# EAGLE design ArduCT-v4 (EAGLE 5.07)
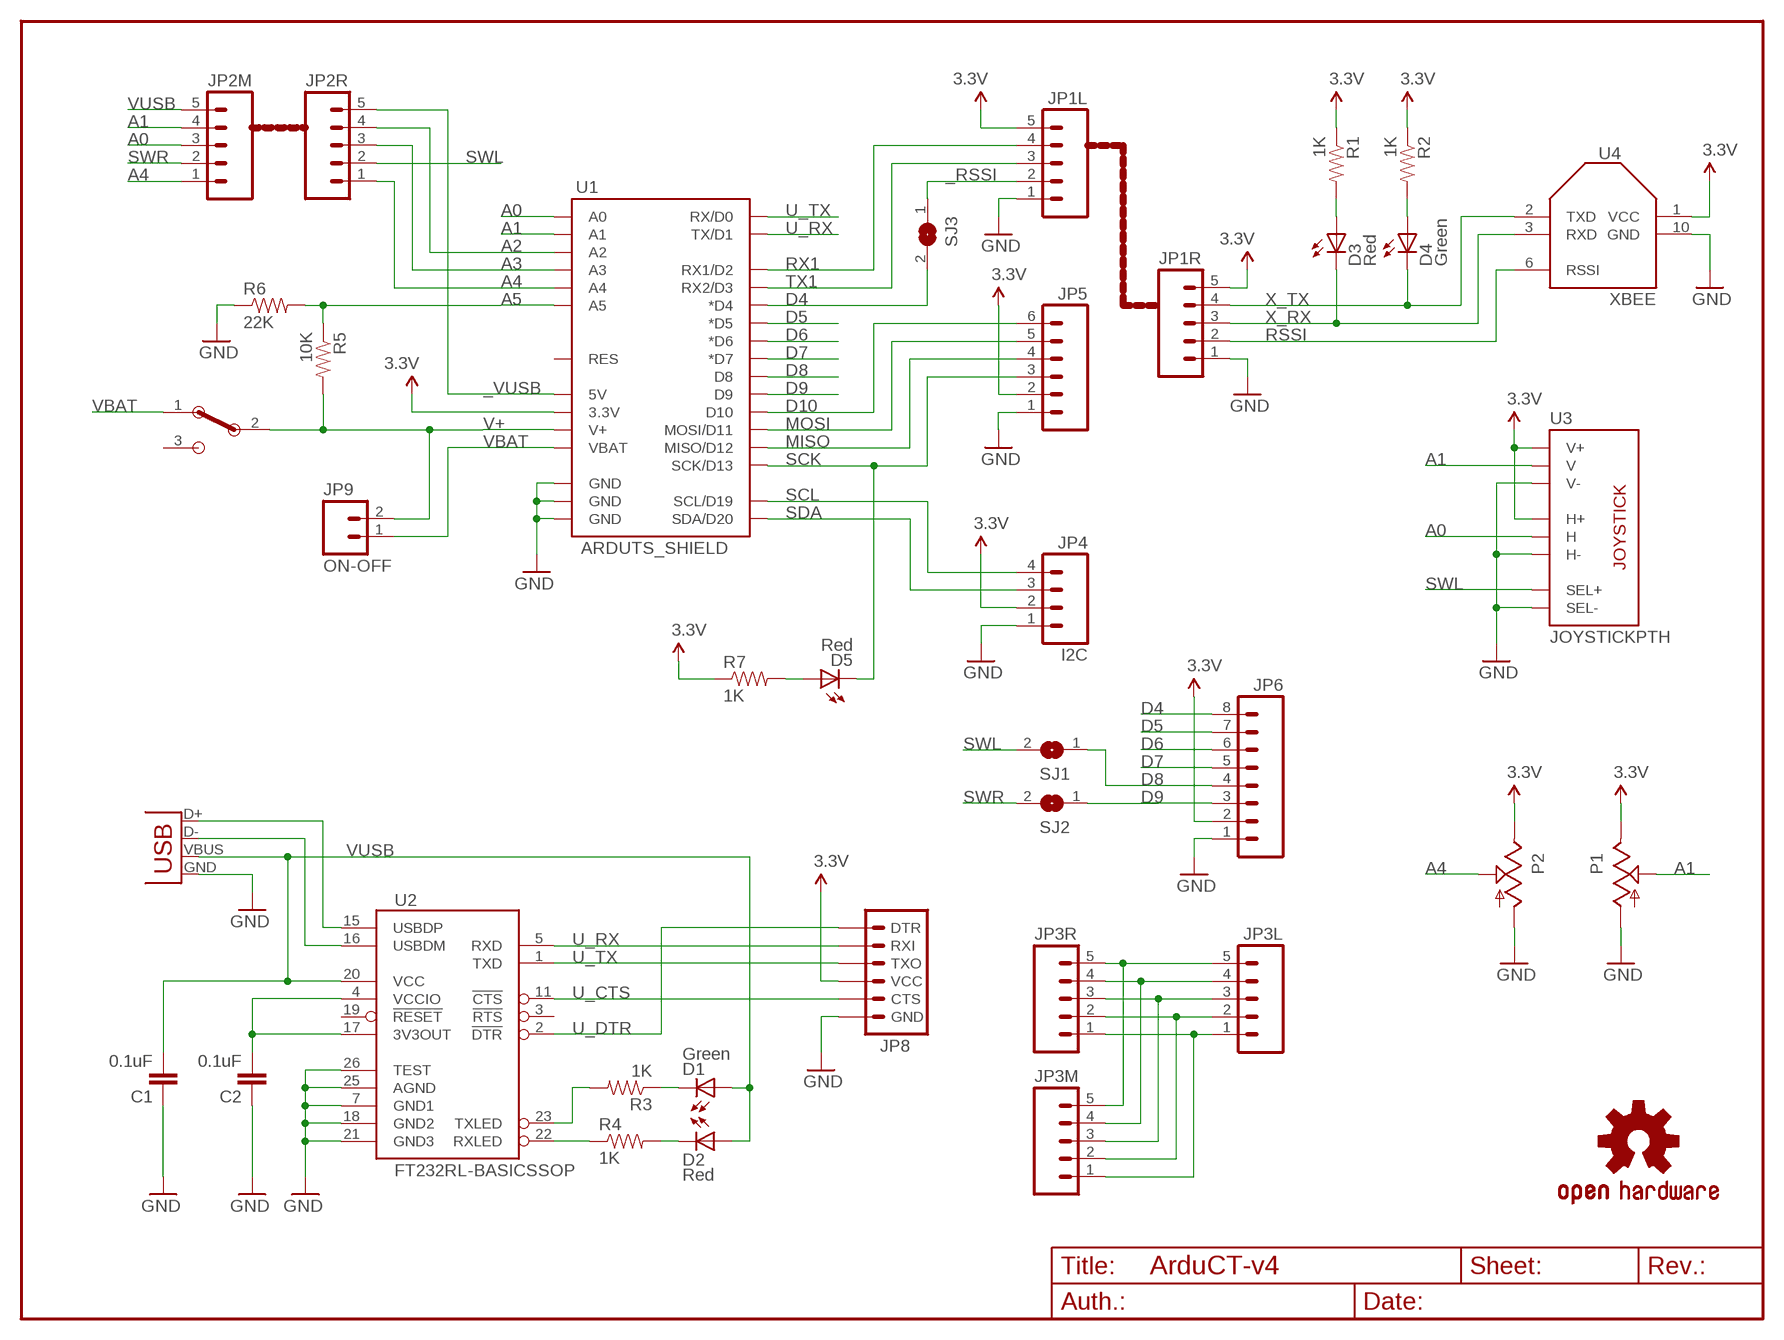
[diagram p0: schematic, sheet 1]

## Parts
C1  0.1uF  CAP0805  [0805]
C2  0.1uF  CAP0805  [0805]
D1  Green  LED  [LED]
D2  Red  LED  [LED]
D3  Red  LED  [LED]
D4  Green  LED  [LED]
D5  Red  LED  [LED]
JP1L  M05  [2+3]
JP1R  M05  [2+3]
JP2M  M05  [2+3]
JP2R  M05  [2+3]
JP3L  M05  [2+3]
JP3M  M05  [2+3]
JP3R  M05  [2+3]
JP4  I2C  M04  [1X04]
JP5  M06SIP  [1X06]
JP6  M08  [1X08]
JP8  ARDUINO_SERIAL_PROGRAM  [1X06_F]
JP9  ON-OFF  M02  [1X02]
P1  POT  [ALPS_POT]
P2  POT  [ALPS_POT]
R1  1K  RESISTOR0805-RES  [0805]
R2  1K  RESISTOR0805-RES  [0805]
R3  1K  RESISTOR0805-RES  [0805]
R4  1K  RESISTOR0805-RES  [0805]
R5  10K  RESISTOR0805-RES  [0805]
R6  22K  RESISTOR0805-RES  [0805]
R7  1K  RESISTOR0805-RES  [0805]
S4  EG1224  [EG1224]
SJ1  SJ  [SJ]
SJ2  SJ  [SJ]
SJ3  SJ  [SJ]
U1  ARDUTS_SHIELD  ARDUTS_SHIELDSPLIT  [ARDUTS_SHIELD_SPLIT]
U2  FT232RL-BASICSSOP  [SSOP28DB]
U3  JOYSTICKPTH  [JOYSTICK]
U4  XBEE  XBEE-RSSI  [XBEE-SMD]
U$1  OSHW-LOGOM  [OSHW-LOGO-M]
X1  USBSMD  [USB-MINIB]

## Nets
3.3V: JP1L.5 JP1R.5 JP4.2 JP5.2 JP6.2 JP8.4(VCC) P1.P$1(E) P2.P$1(E) R1.1 R2.1 R7.1 U1.3.3V U3.H1(H+) U3.V1(V+) U4.1(VCC)
_RSSI: JP1L.2 SJ3.1
_VUSB: JP2R.5 U1.5V
A0: JP2M.3 U1.A0 U3.H2(H)
A1: JP2M.4 P1.P$2(S) U1.A1 U3.V2(V)
A2: JP2R.4 U1.A2
A3: JP2R.3 U1.A3
A4: JP2M.1 JP2R.1 P2.P$2(S) U1.A4
A5: R5.1 R6.2 U1.A5
D4: JP6.8 SJ3.2 U1.D4(*D4)
D5: JP6.7 U1.D5(*D5)
D6: JP6.6 U1.D6(*D6)
D7: JP6.5 U1.D7(*D7)
D8: JP6.4 SJ1.1 U1.D8
D9: JP6.3 SJ2.1 U1.D9
D10: JP5.6 U1.D10
GND [vcc]: C1.1 C2.1 JP1L.1 JP1R.1 JP4.1 JP5.1 JP6.1 JP8.6(GND) P1.P$3(A) P2.P$3(A) R6.1 U1.GND@0(GND) U1.GND@1(GND) U1.GND@2(GND) U2.7(GND1) U2.18(GND2) U2.21(GND3) U2.25(AGND) U2.26(TEST) U3.B2A(SEL-) U3.H3(H-) U3.V3(V-) U4.10(GND) X1.GND
MISO: JP5.4 U1.D12(MISO/D12)
MOSI: JP5.5 U1.D11(MOSI/D11)
N$4: JP3L.4 JP3M.4 JP3R.4
N$5: JP3L.3 JP3M.3 JP3R.3
N$6: JP3L.2 JP3M.2 JP3R.2
N$7: JP3L.5 JP3M.5 JP3R.5
N$8: D5.A1(A) R7.2
N$9: U2.15(USBDP) X1.D+
N$10: U2.16(USBDM) X1.D-
N$14: D3.A1(A) R1.2
N$18: R3.2 U2.23(TXLED)
N$19: C2.2 U2.4(VCCIO) U2.17(3V3OUT)
N$22: R4.1 U2.22(RXLED)
N$25: D4.A1(A) R2.2
RSSI: JP1R.2 U4.6(RSSI)
RX1: JP1L.4 U1.D2(RX1/D2)
SCK: D5.C1(C) JP5.3 U1.D13(SCK/D13)
SCL: JP4.4 U1.D19(SCL/D19)
SDA: JP4.3 U1.D20(SDA/D20)
SWL: JP2R.2 SJ1.2 U3.B1A(SEL+)
SWR: JP2M.2 SJ2.2
TX1: JP1L.3 U1.D3(RX2/D3)
U_CTS: JP8.5(CTS) U2.11(!CTS)
U_DTR: JP8.1(DTR) U2.2(!DTR)
U_RX: JP8.2(RXI) U1.TX(TX/D1) U2.5(RXD)
U_RX_LED: D2.C1(C) R4.2
U_TX: JP8.3(TXO) U1.RX(RX/D0) U2.1(TXD)
U_TX_LED: D1.C1(C) R3.1
V+: JP9.2 R5.2 S4.2 U1.V+
VBAT: JP9.1 S4.1 U1.VBAT
VGND [vcc]: JP3L.1 JP3M.1 JP3R.1
VUSB: C1.2 D1.A1(A) D2.A1(A) JP2M.5 U2.20(VCC) X1.VBUS
X_RX: D3.C1(C) JP1R.3 U4.3(RXD)
X_TX: D4.C1(C) JP1R.4 U4.2(TXD)
Unconnected: S4.3 U1.RES U2.3(!RTS) U2.19(!RESET)

## Library data of the parts
C1 C2 = SparkFun:CAP: Capacitor Standard 0603 ceramic capacitor, and 0.1" leaded capacitor.
D1-D5 = wibauxl:LED
JP1L JP1R JP2M JP2R JP3L JP3M JP3R = wibauxl:M05
JP4 = wibauxl:M04
JP5 = SparkFun:M06: Header 6 Standard 6-pin 0.1" header. Use with straight break away headers (SKU : PRT-00116), right angle break away headers (PRT-00553), swiss pins (PRT-00743), machine pins (PRT-00117), and female headers (PRT-00115). Molex polarized connector foot print use with SKU : PRT-08094 with associated crimp pins and housings. NOTES ON THE VARIANTS LOCK and LOCK_LONGPADS... This footprint was designed to help hold the alignment of a through-hole component (i.e. 6-pin header) while soldering it into place. You may notice that each hole has been shifted either up or down by 0.005 of an inch from it's more standard position (which is a perfectly straight line). This slight alteration caused the pins (the squares in the middle) to touch the edges of the holes. Because they are alternating, it causes a "brace" to hold the component in place. 0.005 has proven to be the perfect amount of "off-center" position when using our standard breakaway headers. Although looks a little odd when you look at the bare footprint, once you have a header in there, the alteration is very hard to notice. Also, if you push a header all the way into place, it is covered up entirely on the bottom side. This idea of altering the position of holes to aid alignment will be further integrated into the Sparkfun Library for other footprints. It can help hold any component with 3 or more connection pins.
JP6 = wibauxl:M08
JP8 = wibauxl:ARDUINO_SERIAL_PROGRAM
JP9 = wibauxl:M02
P1 P2 = SparkFun:POT
R1-R7 = SparkFun:RESISTOR: Resistor Basic schematic elements and footprints for 0603, 1206, and PTH resistors.
S4 = wibauxl:EG1224
SJ1-SJ3 = jumper:SJ: SMD solder JUMPER
U1 = wibauxl:ARDUTS_SHIELD
U2 = wibauxl:FT232RL-BASIC: USB UART This is the simplified version of the FT232RL unit. Only what you need, nothing you don't. Spark Fun Electronics SKU : COM-00650
U3 = SparkFun:JOYSTICK: Thumb Joystick Joystick commonly found in PS2 controllers. Two pots and a select switch. Footprint proven. Spark Fun Electronics SKU : COM-09032
U4 = wibauxl:XBEE-RSSI
U$1 = SparkFun:OSHW-LOGO: Open Source Hardware Logo This logo indicates the piece of hardware it is found on incorporates a OSHW license and/or adheres to the definition of open source hardware found here: http://freedomdefined.org/OSHW
X1 = SparkFun:USB: USB Connectors USB-B-PTH is fully proven SKU : PRT-00139 USB-miniB is fully proven SKU : PRT-00587 USB-A-PCB is untested. USB-A-H is throughly reviewed, but untested. Spark Fun Electronics SKU : PRT-00437 USB-B-SMT is throughly reviewed, but untested. Needs silkscreen touching up. USB-A-S has not been used/tested USB-MB-H has not been used/tested

## Net classes
0 default: width 0.203 mm
1 vcc: width 0.254 mm

## Board
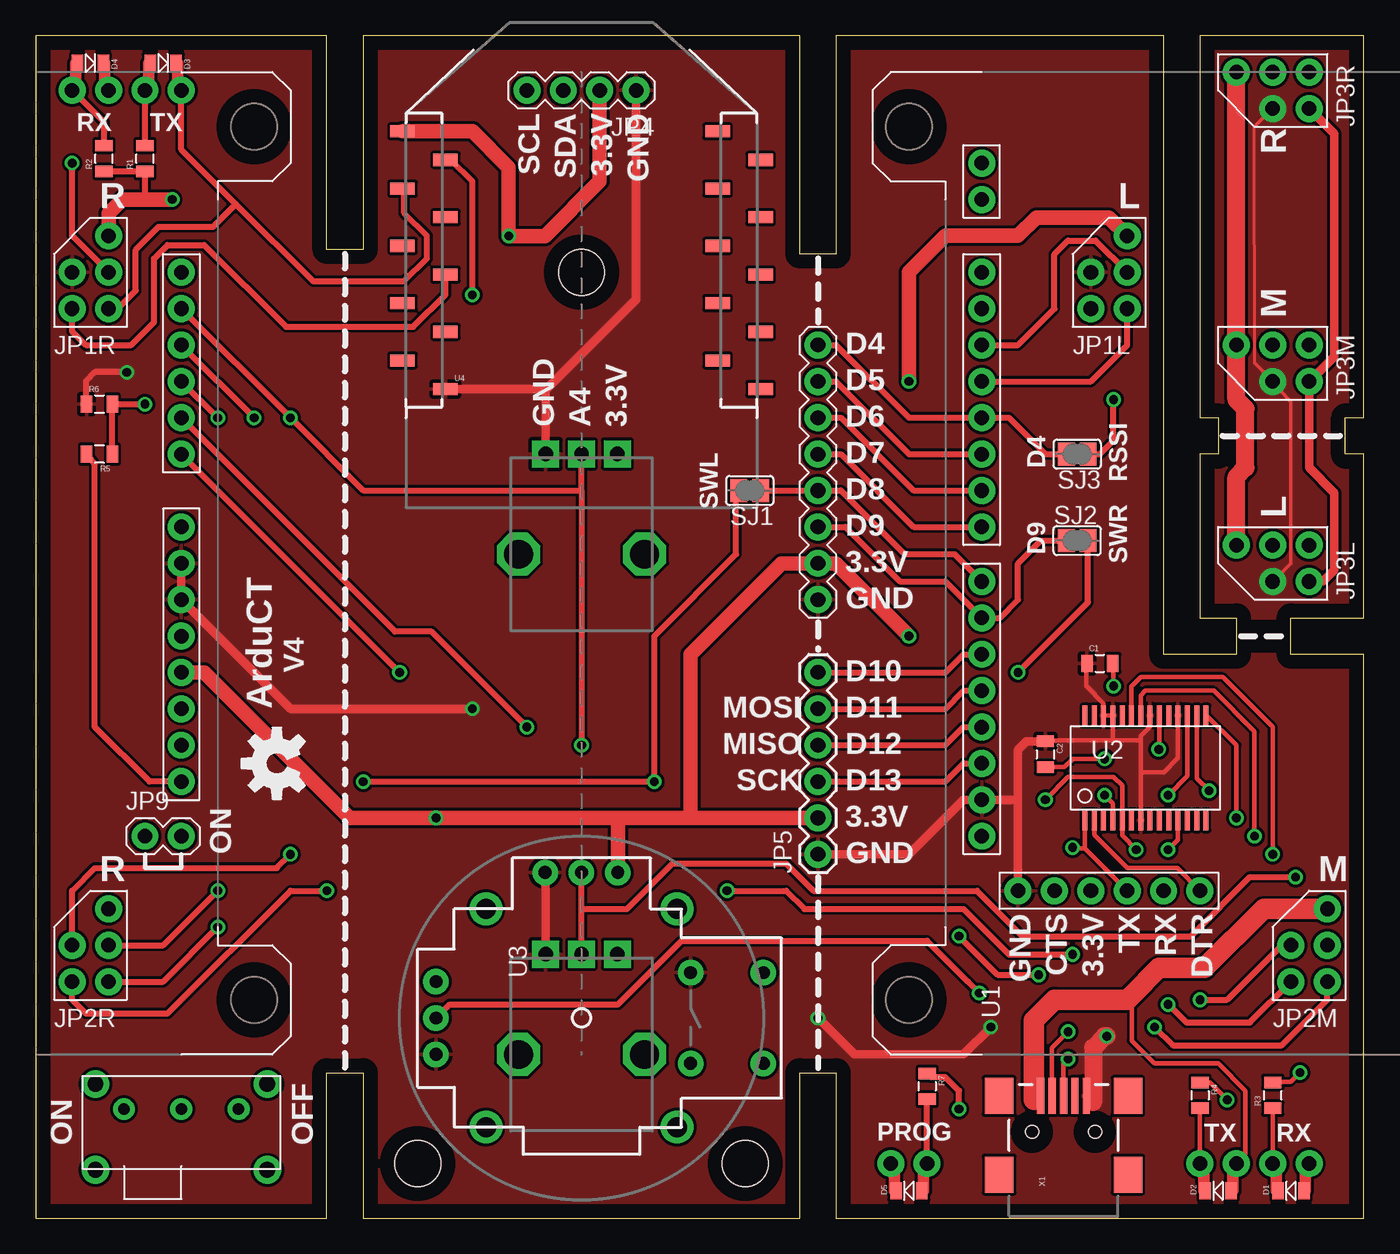
[diagram p1: board, top side]
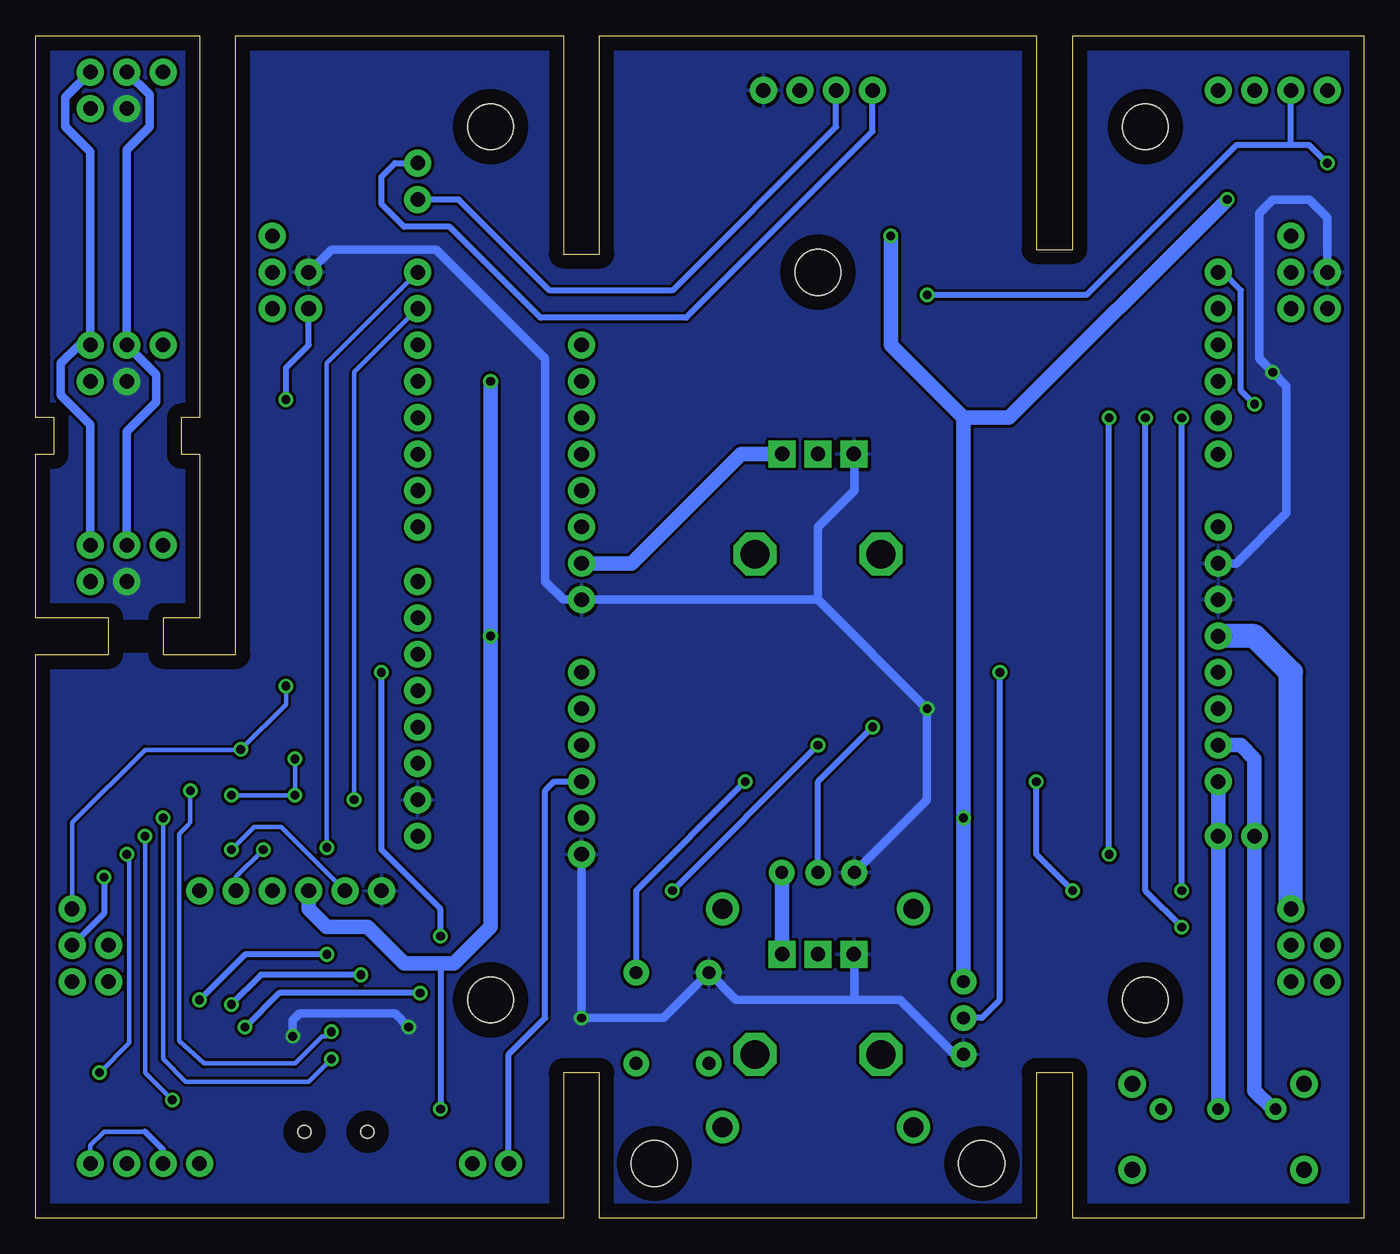
[diagram p2: board, bottom side, seen from below]

Size 92.71 x 82.55 mm. Coordinates in mm from the lower left corner, seen from the top.
Outline: 0,0 20.32,0 20.32,10.16 22.86,10.16 22.86,0 53.34,0 53.34,10.16 55.88,10.16 55.88,0 92.7,0 92.71,39.37 87.63,39.37 87.63,41.91 92.71,41.91 92.71,53.34 91.44,53.34 91.44,55.88 92.71,55.88 92.71,82.54 81.28,82.54 81.28,55.88 82.55,55.88 82.55,53.34 81.28,53.34 81.28,41.91 83.82,41.91 83.82,39.37 78.74,39.37 78.74,82.55 55.88,82.55 55.88,67.31 53.34,67.31 53.34,82.55 22.86,82.55 22.86,67.63 20.32,67.63 20.32,82.54 0,82.54 0,0
Copper layers (1*16): Top 0.035mm / dielectric 1.5mm / Bottom 0.035mm
Design rules "default *": minimum track width 10mil, minimum drill 24mil, track to track 8mil, track to pad 8mil, pad to pad 8mil, via to via 8mil, smd to smd 8mil, copper to edge 40mil, drill to drill 8mil, minimum pad ring 10mil, minimum via ring 8mil, stop-mask expansion 4mil, vias tented up to drill 0mil, thermal gap 10mil
Holes 3.2 mm at 15.24,15.24 60.96,15.24 60.96,76.2 15.24,76.2 49.53,3.81 26.67,3.81 38.1,66.04

### Footprints (pad centres in the part's own frame; a part is rotated, then mirrored left to right if it is on the bottom)
0805 = smd 0.8 x 1.2: 1 -0.9,0; 2 0.9,0
LED = smd 0.8 x 1.2: A -0.9,0; C 0.9,0 | drill 1.016 pad 1.88 round: A1 -1.27,-1.905; C1 1.27,-1.905
2+3 = drill 1.016 pad 1.88 round: 1 -1.27,0; 2 1.27,0; 3 1.27,2.54; 4 -1.27,2.54; 5 -3.81,2.54
1X04 = drill 1.016 pad 1.88 round: 1 0,0; 2 2.54,0; 3 5.08,0; 4 7.62,0
1X06 = drill 1.016 pad 1.88 round: 1 0,0; 2 2.54,0; 3 5.08,0; 4 7.62,0; 5 10.16,0; 6 12.7,0
1X08 = drill 1.016 pad 1.88 round: 1 0,0; 2 2.54,0; 3 5.08,0; 4 7.62,0; 5 10.16,0; 6 12.7,0; 7 15.24,0; 8 17.78,0
1X06_F = drill 1.016 pad 1.88 round: 1 0,0; 2 2.54,0; 3 5.08,0; 4 7.62,0; 5 10.16,0; 6 12.7,0
1X02 = drill 1.016 pad 1.88 round: 1 0,0; 2 2.54,0
ALPS_POT = drill 1 pad 1.88 square: P$1 7,-2.5; P$2 7,0; P$3 7,2.5 | drill 2 octagon: P$4 0,-4.4; P$5 0,4.4
EG1224 = drill 0.8 pad 1.524 round: 1 -4,0; 2 0,0; 3 4,0 | drill 1.1 pad 1.93 round: P$4 6,1.75; P$5 -6,1.75; P$6 -6,-4.25; P$7 6,-4.25
SJ = smd 1.168 x 1.6: 1 -0.762,0; 2 0.762,0
ARDU_C_SHIELD_SPLIT = drill 1.016 pad 1.88 round: 3.3V -27.94,-8.89; 5V -27.94,-6.35; A0 -27.94,6.35; A1 -27.94,8.89; A2 -27.94,11.43; A3 -27.94,13.97; A4 -27.94,16.51; A5 -27.94,19.05; AREF 27.94,-20.32; D2 27.94,13.97; D3 27.94,11.43; D4 27.94,8.89; D5 27.94,6.35; D6 27.94,3.81; D7 27.94,1.27; D8 27.94,-2.54; D9 27.94,-5.08; D10 27.94,-7.62; D11 27.94,-10.16; D12 27.94,-12.7; D13 27.94,-15.24; D19 27.94,26.67; D20 27.94,24.13; GND@0 -27.94,-3.81; GND@1 -27.94,-1.27; GND@2 27.94,-17.78; RES -27.94,-11.43; RX 27.94,19.05; TX 27.94,16.51; V+ -27.94,-16.51; VBAT -27.94,-13.97; VIN -27.94,1.27
SSOP28DB = smd 0.348 x 1.397: 1 -4.225,-3.656; 2 -3.575,-3.656; 3 -2.925,-3.656; 4 -2.275,-3.656; 5 -1.625,-3.656; 6 -0.975,-3.656; 7 -0.325,-3.656; 8 0.325,-3.656; 9 0.975,-3.656; 10 1.625,-3.656; 11 2.275,-3.656; 12 2.925,-3.656; 13 3.575,-3.656; 14 4.225,-3.656; 15 4.225,3.656; 16 3.575,3.656; 17 2.925,3.656; 18 2.275,3.656; 19 1.625,3.656; 20 0.975,3.656; 21 0.325,3.656; 22 -0.325,3.656; 23 -0.975,3.656; 24 -1.625,3.656; 25 -2.275,3.656; 26 -2.925,3.656; 27 -3.575,3.656; 28 -4.225,3.656
JOYSTICK = drill 0.9 pad 1.778 round: B1A -3.175,12.7; B1B 3.175,12.7; B2A -3.175,7.62; B2B 3.175,7.62 | drill 0.889 pad 1.778 round: H1 -2.54,-10.16; H2 0,-10.16; H3 2.54,-10.16; V1 -10.16,2.54; V2 -10.16,0; V3 -10.16,-2.54 | drill 1.397 pad 2.286 round: MOUNT1 -7.62,6.668; MOUNT2 -7.62,-6.668; MOUNT3 7.62,-6.668; MOUNT4 7.62,6.668
XBEE-SMD = smd 1.7 x 0.85: 1 -12.5,20; 2 -9.5,18; 3 -12.5,16; 4 -9.5,14; 5 -12.5,12; 6 -9.5,10; 7 -12.5,8; 8 -9.5,6; 9 -12.5,4; 10 -9.5,2; 11 12.5,2; 12 9.5,4; 13 12.5,6; 14 9.5,8; 15 12.5,10; 16 9.5,12; 17 12.5,14; 18 9.5,16; 19 12.5,18; 20 9.5,20
USB-MINIB = smd 2.5 x 0.5: D+ 2.5,0; D- 2.5,0.8; GND 2.5,-1.6; ID 2.5,-0.8; VBUS 2.5,1.6 | smd 2.5 x 2: MTN1 -3,4.5; MTN2 2.5,4.5; MTN3 -3,-4.5; MTN4 2.5,-4.5 | hole 0.9: 0,2.2; 0,-2.2

### Placement (x,y rotation side)
C1  74.3,38.73 0 top
C2  70.48,32.38 270 top
D1  87.63,1.91 180 top
D2  82.55,1.91 180 top
D3  8.89,80.64 0 top
D4  3.81,80.64 0 top
D5  60.96,1.91 180 top
JP1L  73.66,64.77 270 top
JP1R  2.54,64.77 270 top
JP2M  87.63,17.78 270 top
JP2R  2.54,17.78 270 top
JP3L  87.63,44.45 0 top
JP3M  87.63,58.42 0 top
JP3R  87.63,77.47 0 top
JP4  41.91,78.74 180 top
JP5  54.61,25.4 90 top
JP6  54.61,43.18 90 top
JP8  81.28,22.86 180 top
JP9  7.62,26.67 0 top
P1  38.1,11.43 90 top
P2  38.1,46.35 90 top
R1  7.62,73.98 90 top
R2  4.76,73.98 90 top
R3  86.36,8.57 90 top
R4  81.28,8.57 270 top
R5  4.45,53.34 180 top
R6  4.45,56.83 0 top
R7  62.23,9.21 270 top
S4  10.16,7.62 0 top
SJ1  49.85,50.8 180 top
SJ2  72.71,47.31 0 top
SJ3  72.71,53.34 180 top
U1  ARDU_C_SHIELD  [ARDU_C_SHIELD_SPLIT]  38.1,46.99 0 top
U2  77.47,31.43 0 top
U3  38.1,13.97 270 top
U4  38.1,55.88 0 top
U$1  16.83,31.75 90 top
X1  71.75,6.03 90 top

### Tracks (layer width: path | path; a pad name or v marks a point on that pad's centre or on a via)
3.3V  (via drill 0.61)
  Top 0.305: 52.39,45.72 52.02,45.67
  Top 0.406: R2.1 R1.1 7.62,71.12 6.03,71.12 | v64.45,7.62 64.45,8.89 63.5,9.84 62.49,9.84 R7.1 61.97,10.16
  Top 1.016: U4.1 30.48,75.88 33.02,73.34 v33.02,68.58 35.56,68.58 39.37,72.39 JP4.2 | JP1L.5 74.93,69.85 69.85,69.85 68.58,68.58 63.5,68.58 60.96,66.04 v60.96,58.42 | U1.3.3V 11.75,38.1 21.91,27.94 v27.94,27.94 40.64,27.94 | 45.72,27.94 JP5.2 | 40.64,27.94 45.72,27.94 | 40.64,27.94 U3.V1 | 45.72,27.94 45.72,39.37 52.07,45.72 52.39,45.72 JP6.2 55.88,45.72 v60.96,40.64 | JP1R.5 5.08,70.17 6.03,71.12 v9.53,71.12
  Bottom 0.406: U3.V1 40.6,24.09 | 64.45,17.78 v64.45,7.62
  Bottom 1.016: P2.P$1 43.48,53.35 51.12,45.72 JP6.2 | 40.6,19.09 40.64,18.41 | U3.H1 v27.94,27.94 27.94,55.88 | 40.6,19.09 P1.P$1 | 40.6,24.09 40.6,19.09 | v33.02,68.58 33.02,60.96 27.94,55.88 | 27.94,55.88 24.77,55.88 v9.53,71.12 | v60.96,58.42 v60.96,40.64 60.96,20.32 63.5,17.78 64.45,17.78 66.99,17.78 69.53,20.32 72.39,20.32 73.66,21.59 JP8.4
_RSSI  (via drill 0.61)
  Top 0.406: SJ3.1 73.47,53.78 73.34,53.34 74.3,53.34 75.25,54.29 v75.25,57.15
  Bottom 0.406: v75.25,57.15 75.25,59.37 73.66,60.96 JP1L.2
_VUSB
  Bottom 1.676: U1.5V 7.62,40.64 5.08,38.1 JP2R.5
A0  (via drill 0.61)
  Top 0.406: JP2M.3 90.17,15.24 87,12.06 79.38,12.06 v78.11,13.34 | v65.88,15.72 65.09,16.51 62.23,19.37 45.09,19.37 40.64,14.92 28.89,14.92 U3.H2 | v25.4,38.1 U1.A0
  Bottom 0.406: v78.11,13.34 75.72,15.72 v65.88,15.72 | U3.H2 26.67,13.97 25.4,15.24 v25.4,38.1
A1  (via drill 0.61)
  Top 0.406: v87.95,23.81 84.77,23.81 80.64,19.68 68.9,19.68 65.72,22.86 54.29,22.86 52.39,24.77 44.45,24.77 41.27,21.59 38.1,21.59 | v34.29,34.29 27.62,40.96 25.08,40.96 U1.A1 | 38.1,21.59 U3.V2 | P1.P$2 38.1,21.59
  Bottom 0.406: JP2M.4 87.95,21.27 v87.95,23.81 | v34.29,34.29 38.1,30.48 U3.V2
A2  (via drill 0.61)
  Top 0.406: JP2R.4 8.89,19.05 v12.7,22.86 | v12.7,55.88 U1.A2
  Bottom 0.406: v12.7,22.86 v12.7,55.88
A3  (via drill 0.61)
  Top 0.406: JP2R.3 8.89,16.51 v12.7,20.32 | v15.24,55.88 U1.A3
  Bottom 0.406: v12.7,20.32 15.24,22.86 v15.24,55.88
A4  (via drill 0.61)
  Top 0.406: U1.A4 v17.78,55.88 22.86,50.8 38.1,50.8 | JP2M.1 87,19.05 83.19,15.24 v81.28,15.24 | v72.39,18.41 67.94,18.41 64.77,21.59 53.66,21.59 52.39,22.86 v48.26,22.86 | v17.78,25.4 16.83,24.45 4.13,24.45 2.54,22.86 JP2R.1 | 38.1,50.8 v38.1,33.02 | 38.1,50.8 P2.P$2
  Bottom 0.406: v72.39,18.41 78.11,18.41 v81.28,15.24 | v17.78,25.4 v17.78,55.88 | v38.1,33.02 v48.26,22.86
A5  (via drill 0.61)
  Top 0.406: v7.62,56.83 R6.2 R5.1
  Bottom 0.406: U1.A5 9.84,66.04 8.57,64.77 8.57,57.78 v7.62,56.83
D4
  Top 0.406: JP6.8 55.88,60.96 60.96,55.88 U1.D4 67.94,55.88 70.48,53.34 SJ3.2
D5
  Top 0.406: U1.D5 60.96,53.34 55.88,58.42 JP6.7
D6
  Top 0.406: U1.D6 61.28,50.8 56.2,55.88 JP6.6
D7
  Top 0.406: U1.D7 61.28,48.26 56.2,53.34 JP6.5
D8
  Top 0.406: U1.D8 64.14,46.35 60.64,46.35 56.2,50.8 JP6.4 SJ1.1
D9
  Top 0.406: JP6.3 56.52,48.26 60.33,44.45 63.5,44.45 U1.D9 67.31,41.91 68.58,43.18 68.58,45.72 70.17,47.31 SJ2.1
D10
  Top 0.406: JP5.6 63.5,38.1 64.77,39.37 U1.D10
GND  (via drill 0.61)
  Top 0.305: 77.15,33.34 77.15,33.66 77.8,34.3 U2.21 | C2.1 70.54,33.34 75.25,33.34 | 75.25,33.34 75.19,33.39 U2.25 U2.26 74.55,35.95 73.34,37.15 73.34,38.47 C1.1 | X1.GND 73.62,8.53 73.82,8.1 | 75.25,33.34 77.15,33.34 | 77.14,31.11 77.14,33.33 77.15,33.34 | 77.14,31.11 U2.7 | U2.18 79.75,32.12 78.74,31.11 77.14,31.11
  Top 0.406: 35.6,24.09 U3.V3 | R6.1 3.49,57.15 3.49,58.42 4.13,59.05 v6.35,59.05
  Top 0.61: JP4.1 41.91,64.14 35.6,57.83 35.6,57.78 | C2.1 69.16,33.28 68.58,32.7 68.58,29.21 | 68.58,29.21 U1.GND@2 64.77,29.21 60.96,25.4 JP5.1 | P1.P$3 35.6,24.09 | v30.48,35.56 17.78,35.56 U1.GND@0 U1.GND@1 | P2.P$3 35.6,57.78 | U4.10 35.51,57.88 35.6,57.78 | v66.67,13.34 64.77,11.43 57.15,11.43 v54.61,13.97 | 68.58,29.21 JP8.6
  Top 1.27: 73.82,8.1 73.82,11.91 74.61,12.7 v74.77,12.7
  Bottom 0.406: 35.56,18.39 P1.P$3 35.6,15.28 35.56,15.24
  Bottom 0.61: v74.77,12.7 74.77,13.02 74.77,13.81 74.3,14.29 67.63,14.29 v66.67,13.34 | JP1L.1 72.07,67.63 64.77,67.63 57.15,60.01 57.15,44.45 55.88,43.18 JP6.1 38.1,43.18 | JP5.1 v54.61,13.97 48.9,13.97 U3.B2A 43.81,15.24 35.56,15.24 | 35.56,15.24 35.56,18.39 | 35.56,15.24 32.38,15.24 28.57,11.43 U3.H3 | P2.P$3 35.56,53 35.56,50.8 38.1,48.26 38.1,43.18 | U3.V3 30.48,29.21 v30.48,35.56 38.1,43.18 | U1.GND@1 8.89,45.72 5.4,49.21 5.4,58.1 v6.35,59.05 7.3,60.01 7.3,70.17 6.35,71.12 3.81,71.12 2.54,69.85 JP1R.1
  pour Top: 0,82.55 78.74,82.55 78.74,39.37 92.71,39.37 92.71,0 0,0
  pour Bottom: 0,82.55 78.74,82.55 78.74,39.37 92.71,39.37 92.71,0 0,0
MISO
  Top 0.406: JP5.4 63.5,33.02 64.77,34.29 U1.D12
MOSI
  Top 0.406: JP5.5 63.5,35.56 64.77,36.83 U1.D11
N$4
  Bottom 0.61: JP3R.4 84.77,78.42 84.77,76.2 86.36,74.61 JP3M.4 84.3,58.9 84.3,56.99 86.36,54.93 86.36,50.8 | 86.36,50.8 | 86.36,50.8 JP3L.4
N$5
  Bottom 0.61: JP3R.3 90.65,78.26 90.65,76.2 88.9,74.45 JP3M.3 89.69,60.96 90.96,59.69 | 90.96,59.69 90.96,57.47 88.9,55.4 JP3L.3 | 90.96,59.69
N$6
  Top 0.61: JP3L.2 89.85,44.45 90.65,45.24 90.65,50.64 88.9,52.39 JP3M.2 90.65,60.17 90.65,75.72 JP3R.2
N$7
  Top 1.27: JP3L.5 83.82,51.75 84.45,52.39 84.45,56.52 83.82,57.15 JP3M.5 JP3R.5
N$8
  Top 0.406: D5.A1 R7.2
N$9  (via drill 0.61)
  Top 0.305: U2.15 81.69,35.15 83.82,33.02 v83.82,27.94 | X1.D+ 71.75,11.11 v72.07,11.11
  Bottom 0.305: v83.82,27.94 83.82,11.11 82.23,9.53 73.66,9.53 v72.07,11.11
N$10  (via drill 0.61)
  Top 0.305: v81.92,29.84 81.05,30.71 U2.16 | X1.D- 70.95,11.9 v72.07,13.01
  Bottom 0.305: v81.92,29.84 81.92,27.62 82.07,27.46 82.71,26.83 82.71,12.38 80.96,10.79 74.61,10.79 72.71,12.7 72.39,12.7 v72.07,13.01
N$14
  Top 0.406: R1.2 D3.A1
N$18  (via drill 0.61)
  Top 0.305: U2.23 76.5,37.12 77.15,37.78 82.87,37.78 86.36,34.29 v86.36,25.4 | R3.2 86.36,9.53 87.63,9.53 v88.27,10.16
  Bottom 0.305: v86.36,25.4 86.2,25.08 86.2,12.22 v88.27,10.16
N$19  (via drill 0.61)
  Top 0.305: U2.4 75.19,28.95 v74.61,29.53 | U2.17 80.39,30.86 v79.06,29.53 | C2.2 71.81,31.48 72.39,32.07 v74.61,32.07
  Bottom 0.305: v79.06,29.53 v74.61,29.53 v74.61,32.07
N$22  (via drill 0.61)
  Top 0.305: U2.22 77.14,36.51 77.47,36.83 82.23,36.83 85.09,33.97 v85.09,26.67 | R4.1 81.97,9.47 v83.19,8.26
  Bottom 0.305: v83.19,8.26 85.09,10.16 v85.09,26.67
N$25
  Top 0.406: R2.2 4.76,76.52 D4.A1
RSSI
  Top 0.406: JP1R.2 2.54,61.91 3.49,60.96 6.67,60.96 8.26,62.55 8.26,66.99 9.21,67.94 11.75,67.94 17.46,62.23 26.35,62.23 28.6,64.48 U4.6
RX1
  Top 0.406: U1.D2 68.58,60.96 71.12,63.5 71.12,67.31 72.07,68.26 73.98,68.26 JP1L.4
SCK
  Top 0.406: JP5.3 63.5,30.48 64.77,31.75 U1.D13
  Bottom 0.406: JP5.3 56.52,30.48 57.15,29.84 57.15,13.97 59.69,11.43 D5.C1
SCL
  Bottom 0.406: JP4.4 34.29,75.88 47.31,62.87 57.47,62.87 63.82,69.22 66.99,69.22 68.58,70.8 68.58,72.71 67.63,73.66 U1.D19
SDA
  Bottom 0.406: JP4.3 36.83,76.2 48.26,64.77 56.83,64.77 63.18,71.12 U1.D20
SWL  (via drill 0.61)
  Top 0.406: JP2R.2 2.54,15.24 3.49,14.29 9.21,14.29 17.78,22.86 v20.32,22.86 | v22.86,30.48 v43.18,30.48 43.18,40.64 48.9,46.35 48.9,50.61 SJ1.2
  Bottom 0.406: v43.18,30.48 50.8,22.86 U3.B1A | v20.32,22.86 22.86,25.4 v22.86,30.48
SWR  (via drill 0.61)
  Top 0.406: JP2M.2 84.77,13.65 80.33,13.65 v79.06,14.92 | v70.01,16.99 67.15,16.99 v64.45,19.68 | SJ2.2 73.47,42.99 v68.58,38.1
  Bottom 0.406: v79.06,14.92 76.99,16.99 v70.01,16.99 | v64.45,19.68 64.45,21.59 68.58,25.72 v68.58,38.1
TX1
  Top 0.406: U1.D3 73.66,58.42 75.56,60.33 76.2,60.96 JP1L.3
U_CTS  (via drill 0.61)
  Top 0.305: U2.11 79.75,26.41 v79.06,25.72
  Bottom 0.305: v79.06,25.72 77.47,27.3 75.56,27.3 JP8.5
U_DTR
  Top 0.305: U2.2 73.89,26.75 76.2,24.45 79.69,24.45 JP8.1
U_RX  (via drill 0.61)
  Top 0.305: v70.48,29.21 72.07,30.8 75.25,30.8 75.84,30.2 U2.5 75.84,26.71 v76.83,25.72
  Bottom 0.305: v70.48,29.21 70.48,59.05 U1.TX | v76.83,25.72 78.74,23.81 JP8.2
U_RX_LED
  Top 0.305: D2.C1 R4.2
U_TX  (via drill 0.61)
  Top 0.305: U2.1 73.25,25.82 | 73.25,25.82 JP8.3 | 73.25,25.82 72.45,25.82 v72.39,25.88
  Bottom 0.305: U1.RX 72.39,59.69 v72.39,25.88
U_TX_LED
  Top 0.305: D1.C1 R3.1
V+
  Top 0.406: U1.V+ 7.94,30.48 4.13,34.29 4.13,52.65 R5.2
  Bottom 1.016: S4.2 JP9.2 U1.V+
VBAT
  Bottom 0.61: S4.1 6.35,7.62
  Bottom 1.016: 6.35,7.62 7.62,8.89 JP9.1 7.62,27.94 7.62,32.07 8.57,33.02 U1.VBAT
VGND
  Top 0.203: 85.09,59.69 85.09,76.2
  Top 0.254: 85.09,76.2 JP3R.1 | 85.09,59.69 JP3M.1 87.63,56.99 87.63,45.72 JP3L.1
  pour Bottom (no thermals): 81.28,82.55 92.71,82.55 92.71,41.91 81.28,41.91 81.28,82.23
  pour Top (no thermals): 81.28,82.55 92.71,82.55 92.71,41.91 81.28,41.91
VUSB  (via drill 0.61)
  Top 0.305: U2.20 78.44,33.04 v78.4,32.73 | X1.VBUS 69.89,8.53 69.69,8.26 | D2.A1 84.45,4.45 84.45,8.89 82.55,10.79 78.11,10.79 76.52,12.38 76.52,15.56 | v75.25,37.15 75.25,38.73 C1.2
  Top 1.422: 69.69,8.26 69.69,13.81 71.12,15.24 76.2,15.24 76.52,15.56 78.42,17.46 81.6,17.46 85.72,21.59 JP2M.5
  Bottom 0.305: JP2M.5 90.17,27.62 85.09,32.7 78.42,32.7 v78.4,32.73 75.25,35.88 v75.25,37.15 | 85.09,6.03 87.95,6.03 88.9,5.08 D1.A1
  Bottom 0.406: 85.09,6.03 83.82,4.76 D2.A1
X_RX
  Top 0.406: U4.3 25.6,71.64 25.72,71.75 25.72,70.17 27.3,68.58 27.3,66.99 25.72,65.41 19.37,65.41 13.97,70.8 | 13.97,70.8 10.16,74.61 D3.C1 | JP1R.3 5.71,63.5 6.99,64.77 6.99,67.63 8.57,69.22 12.38,69.22 13.97,70.8
X_TX  (via drill 0.61)
  Top 0.406: U4.2 28.99,73.88 30.48,72.39 v30.48,64.45 | JP1R.4 2.54,68.58 v2.54,73.66
  Bottom 0.406: v30.48,64.45 19.37,64.45 8.89,74.93 5.08,74.93 | 5.08,74.93 D4.C1 | 5.08,74.93 3.81,74.93 v2.54,73.66

### Text on the board
tPlace: SCL | SDA | 3.3V | GND | RX | TX | R | R | L | M | D4 | D5 | GND | A4 | 3.3V | D6 | D7 | D4 | RSSI | SWL | D8 | L | D9 | D9 | SWR | 3.3V | GND | V4 | D10 | ArduCT | MOSI | D11 | MISO | D12 | SCK | D13 | 3.3V | ON | GND | R | M | GND | CTS | 3.3V | TX | RX | DTR | ON | OFF | PROG | TX | RX